# EAGLE design BBB Breakout (EAGLE 7.1.0)
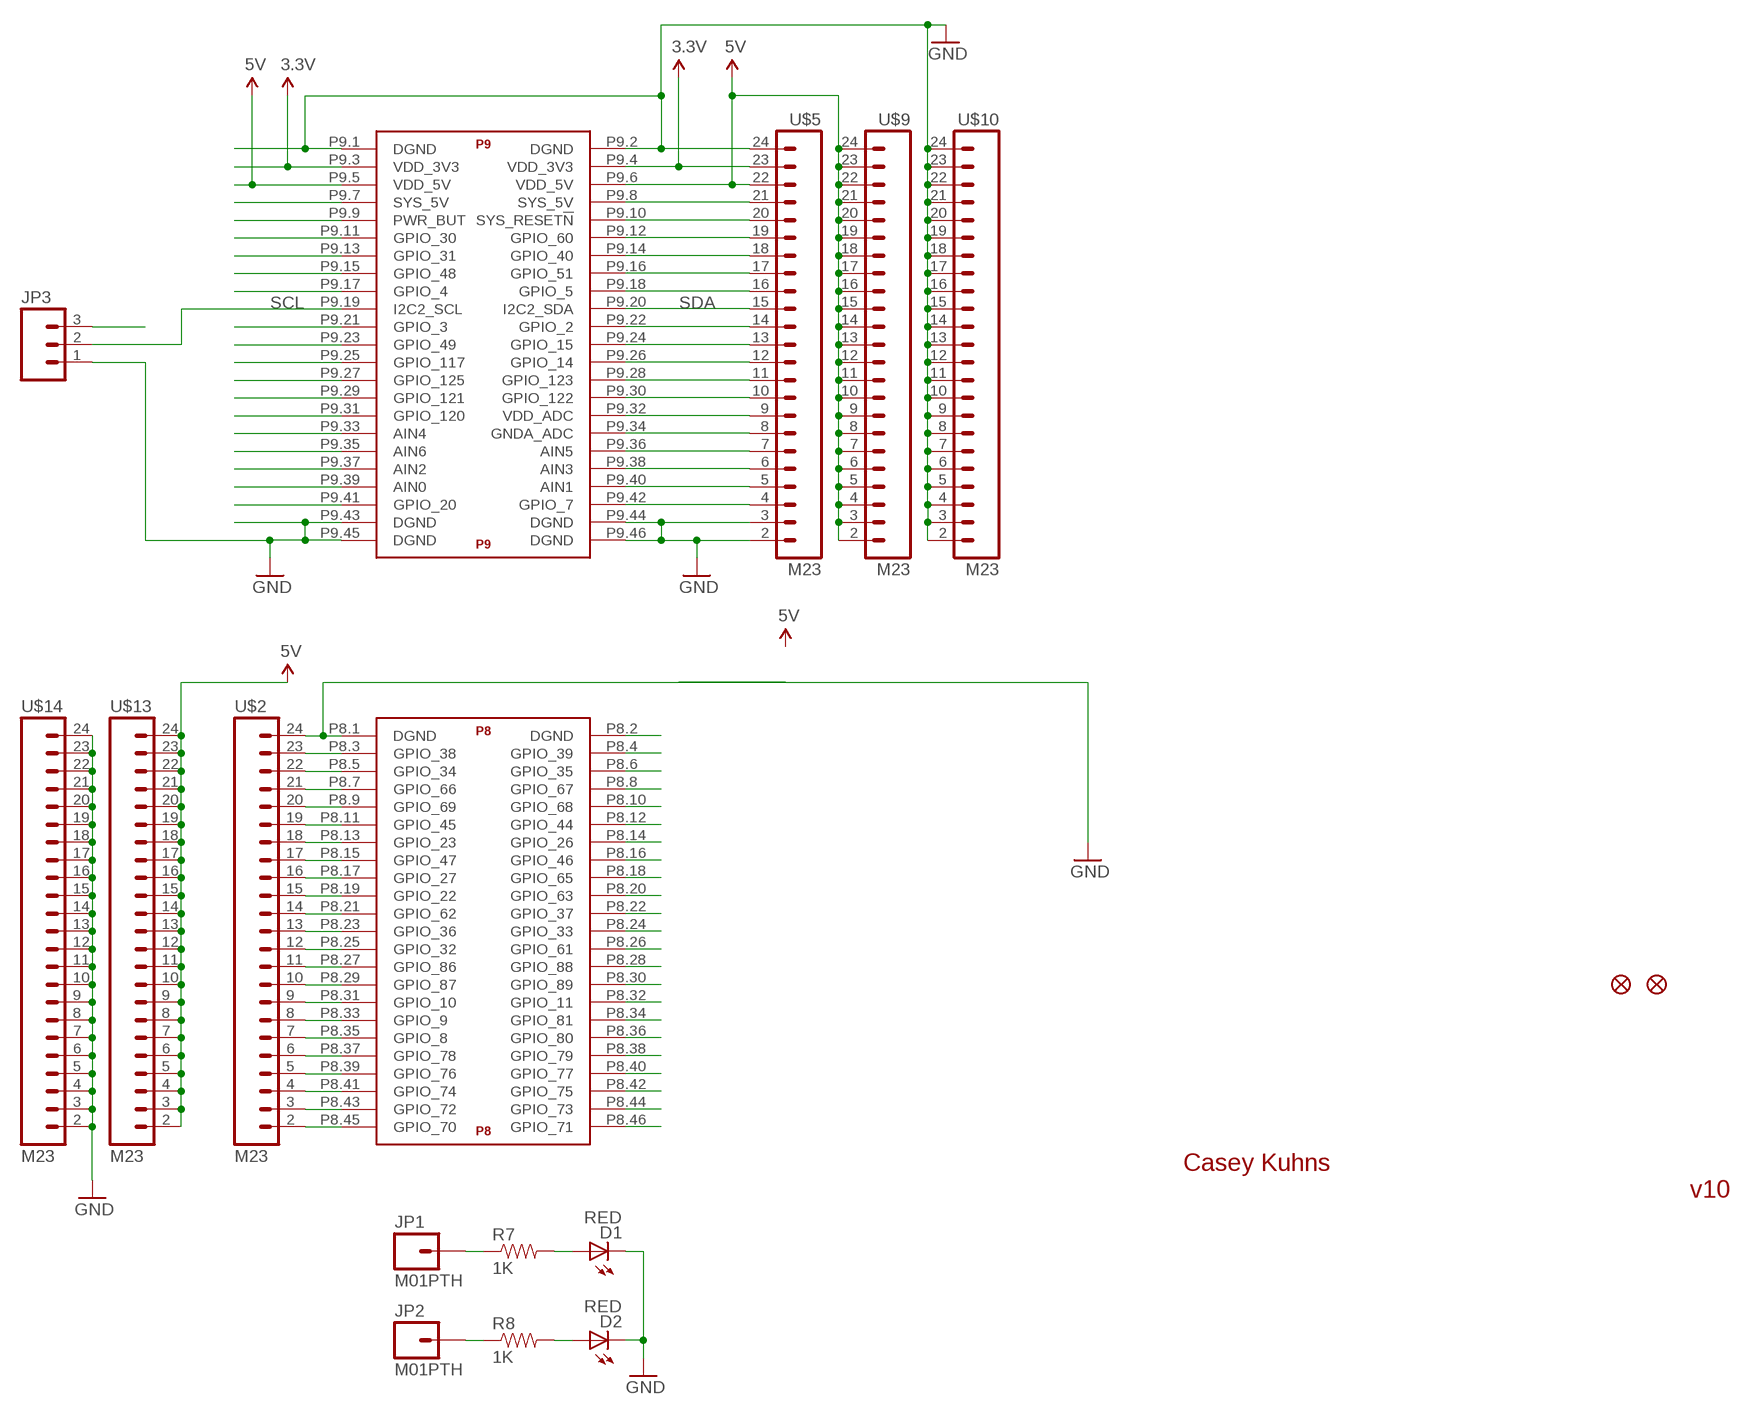
[diagram p0: schematic, sheet 1]

## Parts
D1  RED  LED-RED0603  [LED-0603]
D2  RED  LED-RED0603  [LED-0603]
FID1  FIDUCIAL1X2  [FIDUCIAL-1X2]
FID2  FIDUCIAL1X2  [FIDUCIAL-1X2]
JP1  M01PTH  [1X01]
JP2  M01PTH  [1X01]
JP3  M03PTH  [1X03]
R7  1K  1KOHM1/10W1%(0603)  [0603-RES]
R8  1K  1KOHM1/10W1%(0603)  [0603-RES]
U$1  BEAGLE_BONE_BLACK_CAPE  [BEAGLE_BONE_BLACK_CAPE]
U$2  M23  [1X23]
U$5  M23  [1X23]
U$9  M23  [1X23]
U$10  M23  [1X23]
U$13  M23  [1X23]
U$14  M23  [1X23]

## Nets
3.3V: U$1.P9.3(P9:VDD_3V3) U$1.P9.4(P9:VDD_3V3) U$5.23
5V: U$1.P9.5(P9:VDD_5V) U$1.P9.6(P9:VDD_5V) U$5.22 U$9.2 U$9.3 U$9.4 U$9.5 U$9.6 U$9.7 U$9.8 U$9.9 U$9.10 U$9.11 U$9.12 U$9.13 U$9.14 U$9.15 U$9.16 U$9.17 U$9.18 U$9.19 U$9.20 U$9.21 U$9.22 U$9.23 U$9.24 U$13.2 U$13.3 U$13.4 U$13.5 U$13.6 U$13.7 U$13.8 U$13.9 U$13.10 U$13.11 U$13.12 U$13.13 U$13.14 U$13.15 U$13.16 U$13.17 U$13.18 U$13.19 U$13.20 U$13.21 U$13.22 U$13.23 U$13.24
GND: D1.C D2.C JP3.1 U$1.P8.1(P8:DGND) U$1.P9.1(P9:DGND) U$1.P9.2(P9:DGND) U$1.P9.43(P9:DGND) U$1.P9.44(P9:DGND) U$1.P9.45(P9:DGND) U$1.P9.46(P9:DGND) U$2.24 U$5.2 U$5.3 U$5.24 U$10.2 U$10.3 U$10.4 U$10.5 U$10.6 U$10.7 U$10.8 U$10.9 U$10.10 U$10.11 U$10.12 U$10.13 U$10.14 U$10.15 U$10.16 U$10.17 U$10.18 U$10.19 U$10.20 U$10.21 U$10.22 U$10.23 U$10.24 U$14.2 U$14.3 U$14.4 U$14.5 U$14.6 U$14.7 U$14.8 U$14.9 U$14.10 U$14.11 U$14.12 U$14.13 U$14.14 U$14.15 U$14.16 U$14.17 U$14.18 U$14.19 U$14.20 U$14.21 U$14.22 U$14.23 U$14.24
N$1: U$1.P8.2(P8:DGND)
N$2: U$1.P8.45(P8:GPIO_70) U$2.2
N$3: D1.A R7.2
N$4: U$1.P8.43(P8:GPIO_72) U$2.3
N$5: U$1.P8.41(P8:GPIO_74) U$2.4
N$7: D2.A R8.2
N$8: JP1.1 R7.1
N$9: U$1.P8.39(P8:GPIO_76) U$2.5
N$12: U$1.P8.37(P8:GPIO_78) U$2.6
N$13: U$1.P8.35(P8:GPIO_8) U$2.7
N$14: U$1.P8.33(P8:GPIO_9) U$2.8
N$15: U$1.P8.31(P8:GPIO_10) U$2.9
N$16: U$1.P8.29(P8:GPIO_87) U$2.10
N$17: U$1.P8.27(P8:GPIO_86) U$2.11
N$18: U$1.P8.25(P8:GPIO_32) U$2.12
N$19: U$1.P8.23(P8:GPIO_36) U$2.13
N$20: U$1.P8.21(P8:GPIO_62) U$2.14
N$21: U$1.P8.19(P8:GPIO_22) U$2.15
N$22: U$1.P8.17(P8:GPIO_27) U$2.16
N$23: U$1.P8.15(P8:GPIO_47) U$2.17
N$24: U$1.P8.13(P8:GPIO_23) U$2.18
N$25: U$1.P8.11(P8:GPIO_45) U$2.19
N$26: U$1.P8.9(P8:GPIO_69) U$2.20
N$27: U$1.P8.7(P8:GPIO_66) U$2.21
N$28: U$1.P8.5(P8:GPIO_34) U$2.22
N$29: U$1.P8.3(P8:GPIO_38) U$2.23
N$30: JP2.1 R8.1
N$31: U$1.P8.46(P8:GPIO_71)
N$32: U$1.P8.44(P8:GPIO_73)
N$33: U$1.P8.42(P8:GPIO_75)
N$34: U$1.P8.40(P8:GPIO_77)
N$35: U$1.P8.38(P8:GPIO_79)
N$36: U$1.P8.36(P8:GPIO_80)
N$37: U$1.P8.34(P8:GPIO_81)
N$38: U$1.P8.32(P8:GPIO_11)
N$39: U$1.P8.30(P8:GPIO_89)
N$40: U$1.P8.28(P8:GPIO_88)
N$41: U$1.P8.26(P8:GPIO_61)
N$42: U$1.P8.24(P8:GPIO_33)
N$43: U$1.P8.22(P8:GPIO_37)
N$44: U$1.P8.20(P8:GPIO_63)
N$45: U$1.P8.18(P8:GPIO_65)
N$46: U$1.P8.16(P8:GPIO_46)
N$47: U$1.P8.14(P8:GPIO_26)
N$48: U$1.P8.12(P8:GPIO_44)
N$49: U$1.P8.10(P8:GPIO_68)
N$50: U$1.P8.8(P8:GPIO_67)
N$51: U$1.P8.6(P8:GPIO_35)
N$52: U$1.P8.4(P8:GPIO_39)
N$56: U$1.P9.42(P9:GPIO_7) U$5.4
N$57: U$1.P9.40(P9:AIN1) U$5.5
N$58: U$1.P9.38(P9:AIN3) U$5.6
N$59: U$1.P9.36(P9:AIN5) U$5.7
N$60: U$1.P9.34(P9:GNDA_ADC) U$5.8
N$61: U$1.P9.32(P9:VDD_ADC) U$5.9
N$62: U$1.P9.30(P9:GPIO_122) U$5.10
N$63: U$1.P9.28(P9:GPIO_123) U$5.11
N$64: U$1.P9.26(P9:GPIO_14) U$5.12
N$65: U$1.P9.24(P9:GPIO_15) U$5.13
N$66: U$1.P9.22(P9:GPIO_2) U$5.14
N$68: U$1.P9.18(P9:GPIO_5) U$5.16
N$69: U$1.P9.16(P9:GPIO_51) U$5.17
N$70: U$1.P9.14(P9:GPIO_40) U$5.18
N$71: U$1.P9.12(P9:GPIO_60) U$5.19
N$72: U$1.P9.10(P9:SYS_RESET!N) U$5.20
N$73: U$1.P9.8(P9:SYS_5V) U$5.21
N$79: U$1.P9.41(P9:GPIO_20)
N$80: U$1.P9.39(P9:AIN0)
N$81: U$1.P9.37(P9:AIN2)
N$82: U$1.P9.35(P9:AIN6)
N$83: U$1.P9.33(P9:AIN4)
N$84: U$1.P9.31(P9:GPIO_120)
N$85: U$1.P9.29(P9:GPIO_121)
N$86: U$1.P9.27(P9:GPIO_125)
N$87: U$1.P9.25(P9:GPIO_117)
N$88: U$1.P9.23(P9:GPIO_49)
N$89: U$1.P9.21(P9:GPIO_3)
N$91: U$1.P9.17(P9:GPIO_4)
N$92: U$1.P9.15(P9:GPIO_48)
N$93: U$1.P9.13(P9:GPIO_31)
N$94: U$1.P9.11(P9:GPIO_30)
N$95: U$1.P9.9(P9:PWR_BUT)
N$96: U$1.P9.7(P9:SYS_5V)
SCL: JP3.2 U$1.P9.19(P9:I2C2_SCL)
SDA: JP3.3 U$1.P9.20(P9:I2C2_SDA) U$5.15

## Notes on the sheet
- Casey Kuhns
- v10

## Library data of the parts
D1 D2 = SparkFun-LED:LED-RED: Assorted Red LEDs LilyPad 1206- DIO-09912 1206- DIO-00809 0603- DIO-00819; PROD_ID: DIO-00819
FID1 FID2 = SparkFun-Aesthetics:FIDUCIAL: Fiducial Alignment Points Various fiducial points for machine vision alignment.
JP1 JP2 = SparkFun-Connectors:M01: Header 1 Standard 1-pin 0.1" header. Use with straight break away headers (SKU : PRT-00116), right angle break away headers (PRT-00553), swiss pins (PRT-00743), machine pins (PRT-00117), and female headers (PRT-00115).
JP3 = SparkFun-Connectors:M03: Header 3 Standard 3-pin 0.1" header. Use with straight break away headers (SKU : PRT-00116), right angle break away headers (PRT-00553), swiss pins (PRT-00743), machine pins (PRT-00117), and female headers (PRT-00115). Molex polarized connector foot print use with SKU : PRT-08232 with associated crimp pins and housings.
R7 R8 = SparkFun-Resistors:1KOHM1/10W1%(0603): RES-07856; PROD_ID: RES-07856
U$1 = SparkFun-Boards:BEAGLE_BONE_BLACK_CAPE
U$2 U$5 U$9 U$10 U$13 U$14 = SparkFun-Connectors:M23

## Board
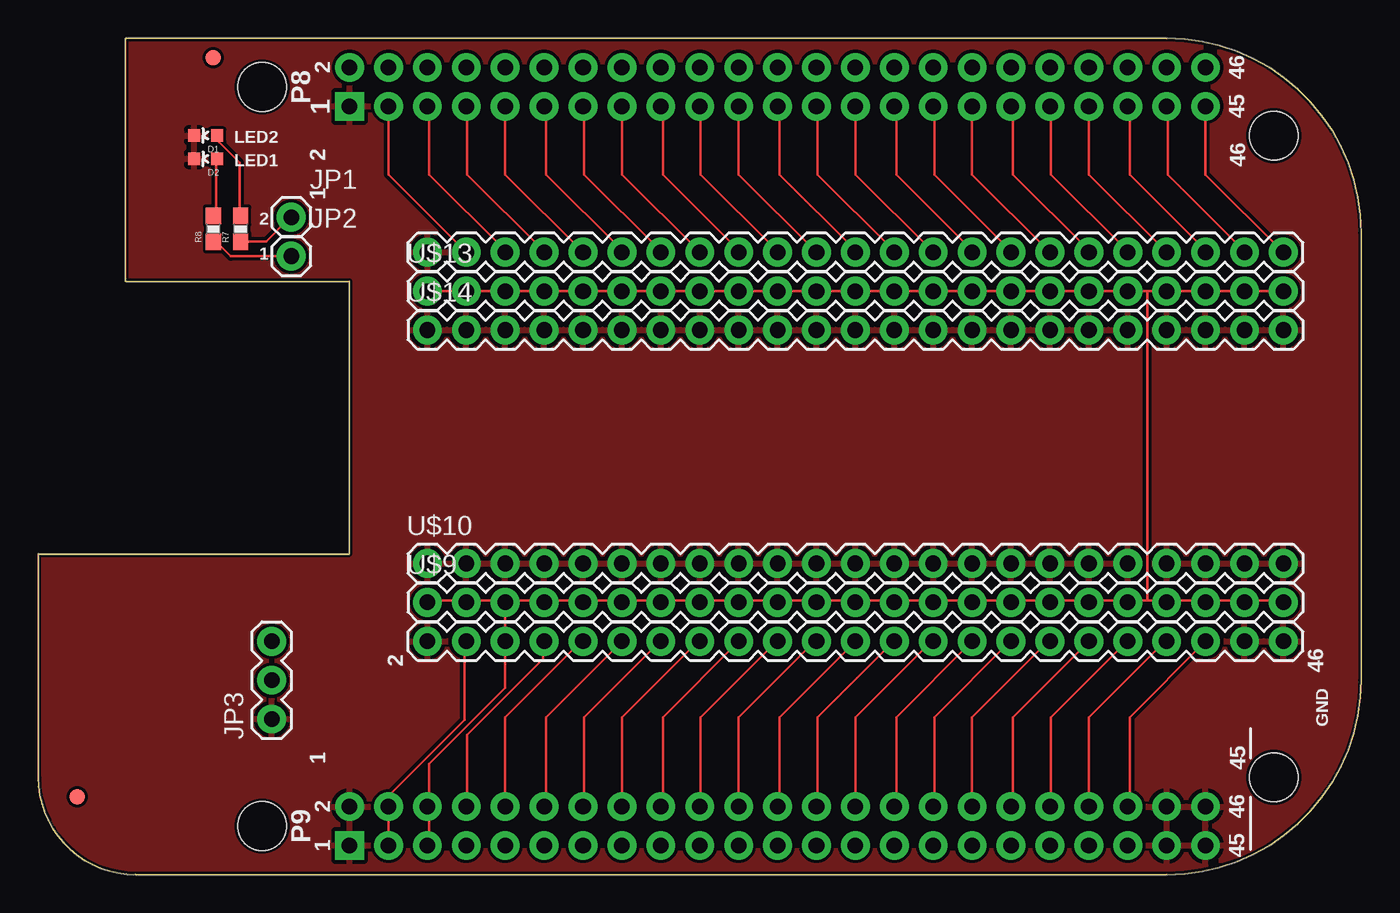
[diagram p1: board, top side]
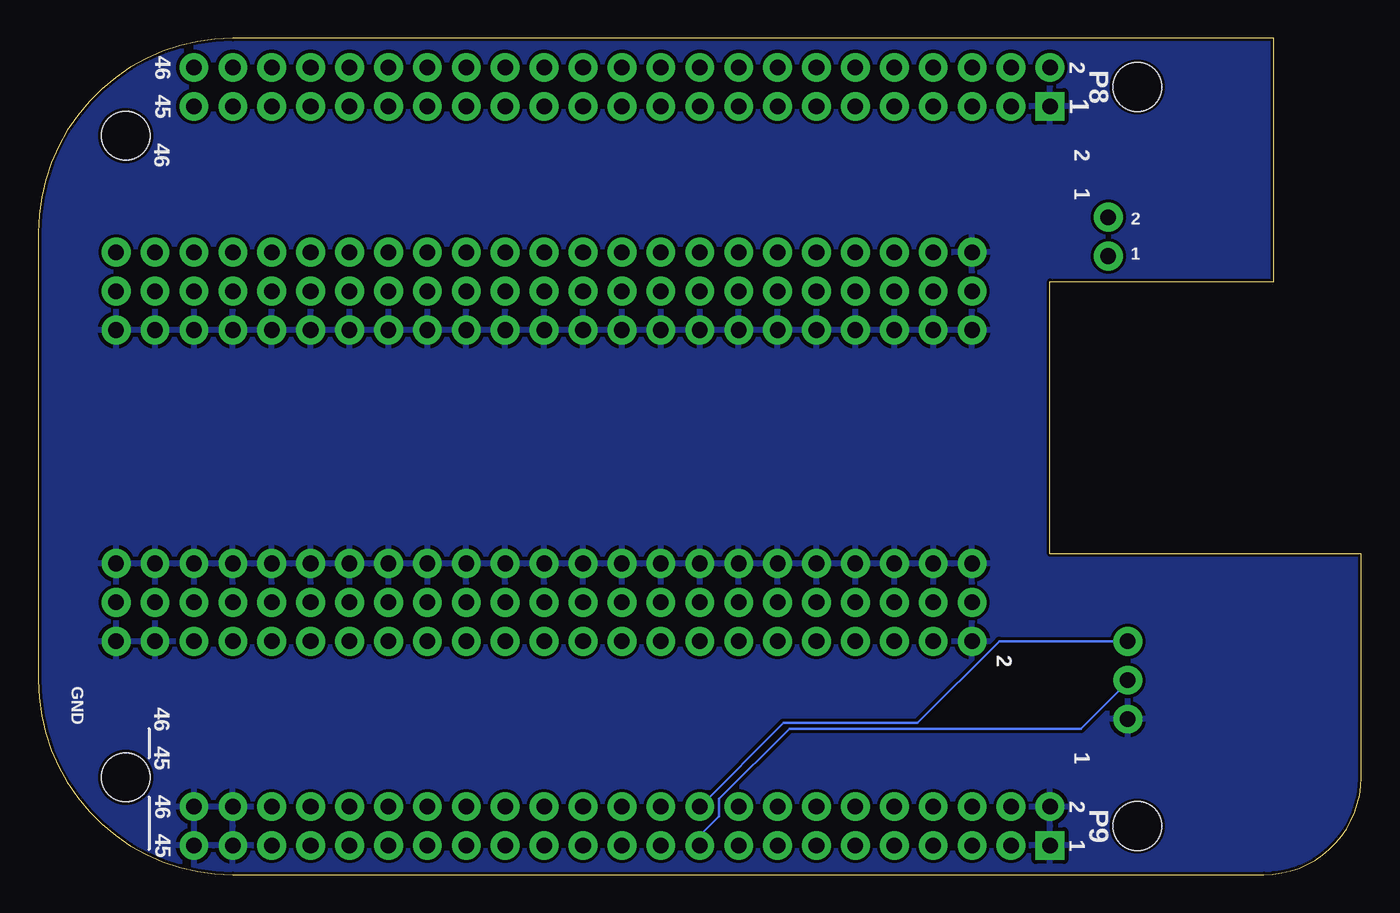
[diagram p2: board, bottom side, seen from below]

Size 86.36 x 54.61 mm. Coordinates in mm from the lower left corner, seen from the top.
Outline: 0,20.95 20.32,20.95 20.32,38.73 5.71,38.73 5.71,54.61 73.66,54.61 arc-90 86.36,41.91 86.36,12.7 arc-90 73.66,0 6.35,0 arc-90 0,6.35 0,20.95
Copper layers (1*16): Top 0.035mm / dielectric 1.5mm / Bottom 0.035mm
Design rules "SparkFun-2-layer": minimum track width 7mil, minimum drill 15mil, track to track 8mil, track to pad 8mil, pad to pad 8mil, via to via 8mil, smd to smd 8mil, copper to edge 8mil, drill to drill 8mil, minimum pad ring 12mil, minimum via ring 10mil, stop-mask expansion 4mil, vias tented up to drill 20mil, thermal gap 10mil

### Footprints (pad centres in the part's own frame; a part is rotated, then mirrored left to right if it is on the bottom)
LED-0603 = smd 0.8 x 0.8: A 0,-0.75; C 0,0.75
FIDUCIAL-1X2 = smd 1 x 1: 1 0,0
1X01 = drill 1.016 pad 1.88: 1 0,0
1X03 = drill 1.016 pad 1.88: 1 0,0; 2 2.54,0; 3 5.08,0
0603-RES = smd 1.1 x 1: 1 -0.85,0; 2 0.85,0
BEAGLE_BONE_BLACK_CAPE = drill 1.016 pad 1.88 square: P8.1 20.32,50.165; P9.1 20.32,1.905 | drill 1.016 pad 1.88: P8.2 20.32,52.705; P8.3 22.86,50.165; P8.4 22.86,52.705; P8.5 25.4,50.165; P8.6 25.4,52.705; P8.7 27.94,50.165; P8.8 27.94,52.705; P8.9 30.48,50.165; P8.10 30.48,52.705; P8.11 33.02,50.165; P8.12 33.02,52.705; P8.13 35.56,50.165; P8.14 35.56,52.705; P8.15 38.1,50.165; P8.16 38.1,52.705; P8.17 40.64,50.165; P8.18 40.64,52.705; P8.19 43.18,50.165; P8.20 43.18,52.705; P8.21 45.72,50.165; P8.22 45.72,52.705; P8.23 48.26,50.165; P8.24 48.26,52.705; P8.25 50.8,50.165; P8.26 50.8,52.705; P8.27 53.34,50.165; P8.28 53.34,52.705; P8.29 55.88,50.165; P8.30 55.88,52.705; P8.31 58.42,50.165; P8.32 58.42,52.705; P8.33 60.96,50.165; P8.34 60.96,52.705; P8.35 63.5,50.165; P8.36 63.5,52.705; P8.37 66.04,50.165; P8.38 66.04,52.705; P8.39 68.58,50.165; P8.40 68.58,52.705; P8.41 71.12,50.165; P8.42 71.12,52.705; P8.43 73.66,50.165; P8.44 73.66,52.705; P8.45 76.2,50.165; P8.46 76.2,52.705; P9.2 20.32,4.445; P9.3 22.86,1.905; P9.4 22.86,4.445; P9.5 25.4,1.905; P9.6 25.4,4.445; P9.7 27.94,1.905; P9.8 27.94,4.445; P9.9 30.48,1.905; P9.10 30.48,4.445; P9.11 33.02,1.905; P9.12 33.02,4.445; P9.13 35.56,1.905; P9.14 35.56,4.445; P9.15 38.1,1.905; P9.16 38.1,4.445; P9.17 40.64,1.905; P9.18 40.64,4.445; P9.19 43.18,1.905; P9.20 43.18,4.445; P9.21 45.72,1.905; P9.22 45.72,4.445; P9.23 48.26,1.905; P9.24 48.26,4.445; P9.25 50.8,1.905; P9.26 50.8,4.445; P9.27 53.34,1.905; P9.28 53.34,4.445; P9.29 55.88,1.905; P9.30 55.88,4.445; P9.31 58.42,1.905; P9.32 58.42,4.445; P9.33 60.96,1.905; P9.34 60.96,4.445; P9.35 63.5,1.905; P9.36 63.5,4.445; P9.37 66.04,1.905; P9.38 66.04,4.445; P9.39 68.58,1.905; P9.40 68.58,4.445; P9.41 71.12,1.905; P9.42 71.12,4.445; P9.43 73.66,1.905; P9.44 73.66,4.445; P9.45 76.2,1.905; P9.46 76.2,4.445 | hole 3.175: 14.605,3.175; 80.645,6.35; 80.645,48.26; 14.605,51.435
1X23 = drill 1.016 pad 1.88: 2 -26.67,0; 3 -24.13,0; 4 -21.59,0; 5 -19.05,0; 6 -16.51,0; 7 -13.97,0; 8 -11.43,0; 9 -8.89,0; 10 -6.35,0; 11 -3.81,0; 12 -1.27,0; 13 1.27,0; 14 3.81,0; 15 6.35,0; 16 8.89,0; 17 11.43,0; 18 13.97,0; 19 16.51,0; 20 19.05,0; 21 21.59,0; 22 24.13,0; 23 26.67,0; 24 29.21,0

### Placement (x,y rotation side)
D1  10.92,48.26 90 top
D2  10.92,46.74 90 top
FID1  2.54,5.08 0 top
FID2  11.43,53.34 0 top
JP1  16.51,42.93 0 top
JP2  16.51,40.39 0 top
JP3  15.24,10.16 90 top
R7  13.21,42.16 90 top
R8  11.43,42.16 90 top
U$1  0,0 0 top
U$2  54.61,40.64 180 top
U$5  54.61,15.24 180 top
U$9  52.07,17.78 0 top
U$10  52.07,20.32 0 top
U$13  52.07,38.1 0 top
U$14  52.07,35.56 0 top

### Tracks (layer width: path | path; a pad name or v marks a point on that pad's centre or on a via)
3.3V
  Top 0.178: U$1.P9.3 U$1.P9.4 22.86,5.14 27.81,10.1 27.81,15.24 U$5.23
5V
  Top 0.178: U$13.24 U$13.23 U$13.22 U$13.21 72.39,38.1 | 72.39,38.1 U$13.20 U$13.19 U$13.18 U$13.17 U$13.16 U$13.15 U$13.14 U$13.13 U$13.12 U$13.11 U$13.10 U$13.9 U$13.8 U$13.7 U$13.6 U$13.5 U$13.4 U$13.3 U$13.2 | 68.58,17.91 66.1,17.91 U$9.18 65.91,17.91 63.63,17.91 U$9.17 63.44,17.91 60.96,17.91 | U$9.24 81.15,17.91 78.87,17.91 U$9.23 78.68,17.91 76.2,17.91 | 72.39,17.91 73.53,17.91 U$9.21 73.72,17.91 76.2,17.91 | 72.39,17.91 71.25,17.91 U$9.20 71.06,17.91 68.58,17.91 | 76.2,17.91 U$9.22 | 68.58,17.91 U$9.19 | 53.34,17.91 50.86,17.91 U$9.12 50.67,17.91 48.39,17.91 U$9.11 48.2,17.91 45.72,17.91 | 60.96,17.91 58.48,17.91 U$9.15 58.29,17.91 56.01,17.91 U$9.14 55.82,17.91 53.34,17.91 | 53.34,17.91 U$9.13 | 38.1,17.91 35.62,17.91 U$9.6 35.43,17.91 33.15,17.91 U$9.5 32.96,17.91 30.48,17.91 | 45.72,17.91 43.24,17.91 U$9.9 43.05,17.91 40.77,17.91 U$9.8 40.58,17.91 38.1,17.91 | 38.1,17.91 U$9.7 | U$9.2 25.53,17.91 27.81,17.91 U$9.3 28,17.91 30.48,17.91 | U$1.P9.5 25.53,1.91 25.53,4.38 U$1.P9.6 25.53,4.57 25.53,7.24 30.48,12.19 U$5.22 U$9.4 30.48,17.91 | 45.72,17.91 U$9.10 | 60.96,17.91 U$9.16 | 72.39,17.91 72.39,38.1
GND
  pour Top (rank 6): 0,20.95 20.32,20.95 20.32,38.73 5.71,38.73 5.71,54.61 74.93,54.61 arc-90 86.36,41.91 86.36,12.7 arc-90 73.66,0 6.35,0 arc-90 0,6.35
  pour Bottom: 0,20.95 20.32,20.95 20.32,38.73 5.71,38.73 5.71,54.61 74.93,54.61 arc-90 86.36,41.91 86.36,12.7 arc-90 73.66,0 6.35,0 arc-90 0,6.35
N$2
  Top 0.178: U$1.P8.45 76.2,45.72 U$2.2
N$3
  Top 0.178: D1.A 11.81,48.2 11.81,47.82 13.14,46.48 13.14,43.05 R7.2
N$4
  Top 0.178: U$1.P8.43 73.72,50.1 73.72,45.72 78.68,40.77 U$2.3
N$5
  Top 0.178: U$1.P8.41 71.25,50.1 71.25,45.72 76.2,40.77 U$2.4
N$7
  Top 0.178: D2.A 11.62,46.67 11.62,43.24 11.43,43.05 R8.2
N$8
  Top 0.178: R7.1 13.34,41.34 14.86,41.34 16.38,42.86 JP1.1
N$9
  Top 0.178: U$1.P8.39 68.58,45.72 U$2.5
N$12
  Top 0.178: U$1.P8.37 66.1,50.1 66.1,45.72 71.06,40.77 U$2.6
N$13
  Top 0.178: U$1.P8.35 63.63,50.1 63.63,45.72 68.58,40.77 U$2.7
N$14
  Top 0.178: U$1.P8.33 60.96,45.72 U$2.8
N$15
  Top 0.178: U$1.P8.31 58.48,50.1 58.48,45.72 63.44,40.77 U$2.9
N$16
  Top 0.178: U$1.P8.29 56.01,50.1 56.01,45.72 60.96,40.77 U$2.10
N$17
  Top 0.178: U$1.P8.27 53.34,45.72 U$2.11
N$18
  Top 0.178: U$1.P8.25 50.86,50.1 50.86,45.72 55.82,40.77 U$2.12
N$19
  Top 0.178: U$1.P8.23 48.39,50.1 48.39,45.72 53.34,40.77 U$2.13
N$20
  Top 0.178: U$1.P8.21 45.72,45.72 U$2.14
N$21
  Top 0.178: U$1.P8.19 43.24,50.1 43.24,45.72 48.2,40.77 U$2.15
N$22
  Top 0.178: U$1.P8.17 40.77,50.1 40.77,45.72 45.72,40.77 U$2.16
N$23
  Top 0.178: U$1.P8.15 38.1,45.72 U$2.17
N$24
  Top 0.178: U$1.P8.13 35.62,50.1 35.62,45.72 40.58,40.77 U$2.18
N$25
  Top 0.178: U$1.P8.11 33.15,50.1 33.15,45.72 38.1,40.77 U$2.19
N$26
  Top 0.178: U$1.P8.9 30.48,45.72 U$2.20
N$27
  Top 0.178: U$1.P8.7 28,50.1 28,45.72 32.96,40.77 U$2.21
N$28
  Top 0.178: U$1.P8.5 25.53,50.1 25.53,45.72 30.48,40.77 U$2.22
N$29
  Top 0.178: U$1.P8.3 22.86,45.72 U$2.23
N$30
  Top 0.178: JP2.1 12.57,40.39 11.81,41.15 11.43,41.15 R8.1
N$56
  Top 0.178: U$5.4 71.25,10.29 71.25,4.57 U$1.P9.42
N$57
  Top 0.178: U$1.P9.40 68.58,10.29 73.53,15.24 U$5.5
N$58
  Top 0.178: U$1.P9.38 66.1,4.57 66.1,10.29 71.06,15.24 U$5.6
N$59
  Top 0.178: U$5.7 63.63,10.29 63.63,4.57 U$1.P9.36
N$60
  Top 0.178: U$1.P9.34 60.96,10.29 65.91,15.24 U$5.8
N$61
  Top 0.178: U$1.P9.32 58.48,4.57 58.48,10.29 63.44,15.24 U$5.9
N$62
  Top 0.178: U$5.10 56.01,10.29 56.01,4.57 U$1.P9.30
N$63
  Top 0.178: U$1.P9.28 53.34,10.29 58.29,15.24 U$5.11
N$64
  Top 0.178: U$1.P9.26 50.86,4.57 50.86,10.29 55.82,15.24 U$5.12
N$65
  Top 0.178: U$5.13 48.39,10.29 48.39,4.57 U$1.P9.24
N$66
  Top 0.178: U$1.P9.22 45.72,10.29 50.67,15.24 U$5.14
N$68
  Top 0.178: U$5.16 40.77,10.29 40.77,4.57 U$1.P9.18
N$69
  Top 0.178: U$1.P9.16 38.1,10.29 43.05,15.24 U$5.17
N$70
  Top 0.178: U$1.P9.14 35.62,4.57 35.62,10.29 40.58,15.24 U$5.18
N$71
  Top 0.178: U$5.19 33.15,10.29 33.15,4.57 U$1.P9.12
N$72
  Top 0.178: U$1.P9.10 30.48,10.29 35.43,15.24 U$5.20
N$73
  Top 0.178: U$1.P9.8 28,4.57 28,9.14 32.96,14.1 32.96,15.24 U$5.21
SCL
  Bottom 0.178: U$1.P9.19 43.05,1.91 43.05,2.67 41.91,3.81 41.91,4.95 37.34,9.53 18.29,9.53 15.24,12.57 JP3.2
SDA
  Top 0.178: U$1.P9.20 43.24,4.57 43.24,10.29 48.2,15.24 U$5.15
  Bottom 0.178: JP3.3 23.62,15.24 28.96,9.91 37.72,9.91 U$1.P9.20

### Text on the board
tPlace: LED2 | 2 | 46 | LED1 | 1 | 2 | 1 | 2 | 46 | GND | 1 | 45
bPlace: 2 | 46 | 1 | 2 | 1 | 2 | 46 | GND | 1 | 45